# Altium project Hub-UV17.PrjPcb
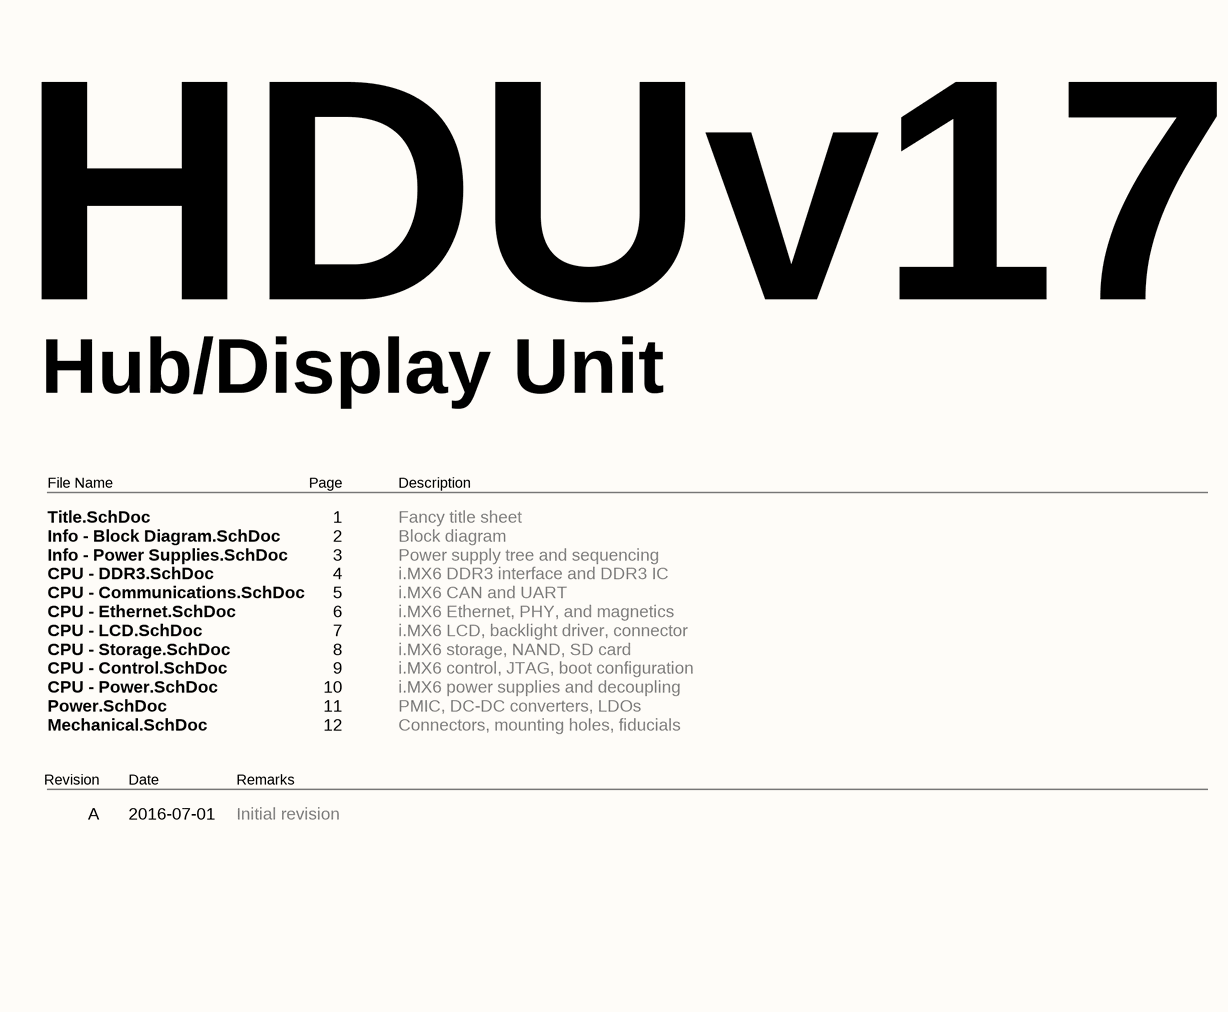
[diagram p0: Title.SchDoc]
ProjectTitle: HDU: Hub/Display Unit; ProjectRevision: A; ProjectDate: 2017-04-01; ProjectCar: UV17
10 sheets, 113 parts. Net scope: global (net labels, ports and power ports of the same name join across sheets).
Board file: Hub-UV17.PcbDoc
Sheets:
  Title.SchDoc
  Power.SchDoc
  CPU - DDR3.SchDoc
  CPU - Communications.SchDoc
  CPU - Ethernet.SchDoc
  CPU - LCD.SchDoc
  CPU - Storage.SchDoc
  CPU - Control.SchDoc
  CPU - Power.SchDoc
  Mechanical.SchDoc

## Sheet Title.SchDoc: Title
size Tabloid; Revision: A; ProjectTitle: HDU: Hub/Display Unit

### Notes on the sheet
- HDUv17
- Hub/Display Unit
- File Name
- Page
- Description
- Title.SchDoc
  Info - Block Diagram.SchDoc
  Info - Power Supplies.SchDoc
  CPU - DDR3.SchDoc
  CPU - Communications.SchDoc
  CPU - Ethernet.SchDoc
  CPU - LCD.SchDoc
  CPU - Storage.SchDoc
  CPU - Control.SchDoc
  CPU - Power.SchDoc
  Power.SchDoc
  Mechanical.SchDoc
- 1
  2
  3
  4
  5
  6
  7
  8
  9
  10
  11
  12
- Fancy title sheet
  Block diagram
  Power supply tree and sequencing
  i.MX6 DDR3 interface and DDR3 IC
  i.MX6 CAN and UART
  i.MX6 Ethernet, PHY, and magnetics
  i.MX6 LCD, backlight driver, connector
  i.MX6 storage, NAND, SD card
  i.MX6 control, JTAG, boot configuration
  i.MX6 power supplies and decoupling
  PMIC, DC-DC converters, LDOs
  Connectors, mounting holes, fiducials
- Revision
- Date
- Remarks
- Initial revision
- A
- 2016-07-01
- Date:
- Revision:
- Sheet:
- /

## Sheet Power.SchDoc: Title
size Tabloid; Revision: A; ProjectTitle: CDU: CAN Display Unit
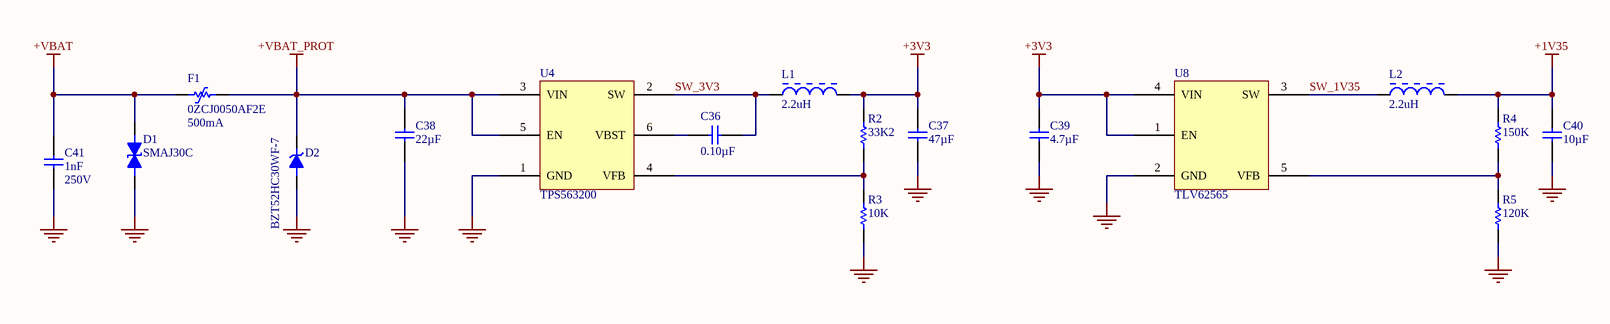
[diagram p1: Power.SchDoc]

### Parts
C36  value 0.10µF  [CAP-0402-M]  (hidden comment: CAP 0.10µF ±10% 25V 0402 X7R)
C37  value 47µF  [CAP-1210-M]  (hidden comment: CAP 47µF ±20% 6.3V 1210 X5R)
C38  value 22µF  [CAP-1210-M]  (hidden comment: CAP 22µF ±10% 25V 1210 X5R)
C39  value 4.7µF  [CAP-0805-M]  (hidden comment: CAP 4.7µF ±10% 6.3V 0805 X5R)
C40  value 10µF  [CAP-0805-M]  (hidden comment: CAP 10µF ±10% 6.3V 0805 X5R)
C41  value 1nF  Voltage: 250V  [CAP-0805-M]  (hidden comment: CAP 1nF ±10% 250V 0805 X7R)
D1  SMAJ30C  [SON127P500X135-2N]
D2  BZT52HC30WF-7  [SODFL340X115-2N]
F1  0ZCJ0050AF2E  value 500mA  [0ZCJ-1206-0.9]
L1  value 2.2uH  [INDP8080X40N]  (hidden comment: SRN8040-2R2Y)
L2  value 2.2uH  [INDP4848X28N]  (hidden comment: SRR4028-2R2Y)
R2  value 33K2  [RES-0603-M]  (hidden comment: RES 33K2 1% 1/10 W 0603 ±100ppm/°C)
R3  value 10K  [RES-0603-M]  (hidden comment: RES 10K 1% 1/10 W 0603 ±100ppm/°C)
R4  value 150K  [RES-0603-M]  (hidden comment: RES 150K 1% 1/10 W 0603 ±100ppm/°C)
R5  value 120K  [RES-0603-M]  (hidden comment: RES 120K 1% 1/10 W 0603 ±100ppm/°C)
U4  TPS563200  [TSOP95P280X110-6N]
U8  TLV62565  [SOT95P280X145-5N]

### Nets
+1V35: C40.2 L2.2 R4.2
+3V3: C37.2 C39.2 L1.2 R2.2 U8.1(EN) U8.4(VIN)
+VBAT: C41.1 D1.1 F1.1
+VBAT_PROT: C38.2 D2.1(K) F1.2 U4.3(VIN) U4.5(EN)
GND: C37.1 C38.1 C39.1 C40.1 C41.2 D1.2 D2.2(A) R3.1 R5.1 U4.1(GND) U8.2(GND)
SW_1V35: L2.1 U8.3(SW)
SW_3V3: C36.2 L1.1 U4.2(SW)
NetC36_1: C36.1 U4.6(VBST)
NetR2_1: R2.1 R3.2 U4.4(VFB)
NetR4_1: R4.1 R5.2 U8.5(VFB)

### Notes on the sheet
- Date:
- Revision:
- Sheet:
- /

### Library data of the parts
C36 = CC0402KRX7R8BB104: Manufacturer: Yageo; Manufacturer Series: CC; Part Number: CC0402KRX7R8BB104; Component Type: Standard; Tolerance: ±10%; Voltage: 25V; Package: 0402; Temperature Coefficient: X7R; Temperature Range: -55°C ~ 125°C; Supplier 1: Digi-Key; Supplier Part Number 1: 311-2077-1-ND
C37 = CC1210MKX5R5BB476: Manufacturer: Yageo; Manufacturer Series: CC; Part Number: CC1210MKX5R5BB476; Component Type: Standard; Tolerance: ±20%; Voltage: 6.3V; Package: 1210; Temperature Coefficient: X5R; Temperature Range: -55°C ~ 85°C; Supplier 1: Digi-Key; Supplier Part Number 1: 311-2047-1-ND
C38 = CC1210KKX5R8BB226: Manufacturer: Yageo; Manufacturer Series: CC; Part Number: CC1210KKX5R8BB226; Component Type: Standard; Tolerance: ±10%; Voltage: 25V; Package: 1210; Temperature Coefficient: X5R; Temperature Range: -55°C ~ 85°C; Supplier 1: Digi-Key; Supplier Part Number 1: 311-2021-1-ND
C39 = CC0805KKX5R5BB475: Manufacturer: Yageo; Manufacturer Series: CC; Part Number: CC0805KKX5R5BB475; Component Type: Standard; Tolerance: ±10%; Voltage: 6.3V; Package: 0805; Temperature Coefficient: X5R; Temperature Range: -55°C ~ 85°C; Supplier 1: Digi-Key; Supplier Part Number 1: 311-1861-1-ND
C40 = CC0805KKX5R5BB106: Manufacturer: Yageo; Manufacturer Series: CC; Part Number: CC0805KKX5R5BB106; Component Type: Standard; Tolerance: ±10%; Voltage: 6.3V; Package: 0805; Temperature Coefficient: X5R; Temperature Range: -55°C ~ 85°C; Supplier 1: Digi-Key; Supplier Part Number 1: 311-1459-1-ND
C41 = CC0805KRX7RYBB102: Manufacturer: Yageo; Manufacturer Series: CC; Part Number: CC0805KRX7RYBB102; Component Type: Standard; Tolerance: ±10%; Package: 0805; Temperature Coefficient: X7R; Temperature Range: -55°C ~ 125°C; Supplier 1: Digi-Key; Supplier Part Number 1: 311-1470-1-ND
R2 = RC0603FR-0733K2L: Manufacturer: Yageo; Manufacturer Series: RC; Power: 1/10 W; Part Number: RC0603FR-0733K2L; Component Type: Standard; Tolerance: 1%; Package: 0603; Temperature Coefficient: ±100ppm/°C; Temperature Range: -55°C ~ 155°C; Supplier 1: Digi-Key; Supplier Part Number 1: 311-33.2KHRCT-ND
R3 = RC0603FR-0710KL: Manufacturer: Yageo; Manufacturer Series: RC; Power: 1/10 W; Part Number: RC0603FR-0710KL; Component Type: Standard; Tolerance: 1%; Package: 0603; Temperature Coefficient: ±100ppm/°C; Temperature Range: -55°C ~ 155°C; Supplier 1: Digi-Key; Supplier Part Number 1: 311-10.0KHRCT-ND
R4 = RC0603FR-07150KL: Manufacturer: Yageo; Manufacturer Series: RC; Power: 1/10 W; Part Number: RC0603FR-07150KL; Component Type: Standard; Tolerance: 1%; Package: 0603; Temperature Coefficient: ±100ppm/°C; Temperature Range: -55°C ~ 155°C; Supplier 1: Digi-Key; Supplier Part Number 1: 311-150KHRCT-ND
R5 = RC0603FR-07120KL: Manufacturer: Yageo; Manufacturer Series: RC; Power: 1/10 W; Part Number: RC0603FR-07120KL; Component Type: Standard; Tolerance: 1%; Package: 0603; Temperature Coefficient: ±100ppm/°C; Temperature Range: -55°C ~ 155°C; Supplier 1: Digi-Key; Supplier Part Number 1: 311-120KHRCT-ND
U4 = TPS563200: 4.5-V To 17-V Input, 2-A, 3-A Synchronous Step-Down Voltage Regulator In  6 Pin SOT-23
U8 = TLV62565: x 1.5-A High Efficiency Step-Down Converters in SOT-23 5-Pin Package
D2 = BZT52HC30WF-7: Supplier 1: Digi-Key; Supplier Part Number 1: BZT52HC30WF-7DICT-ND

## Sheet CPU - DDR3.SchDoc: DDR3 SDRAM
size Tabloid; Revision: A; ProjectTitle: CDU: CAN Display Unit
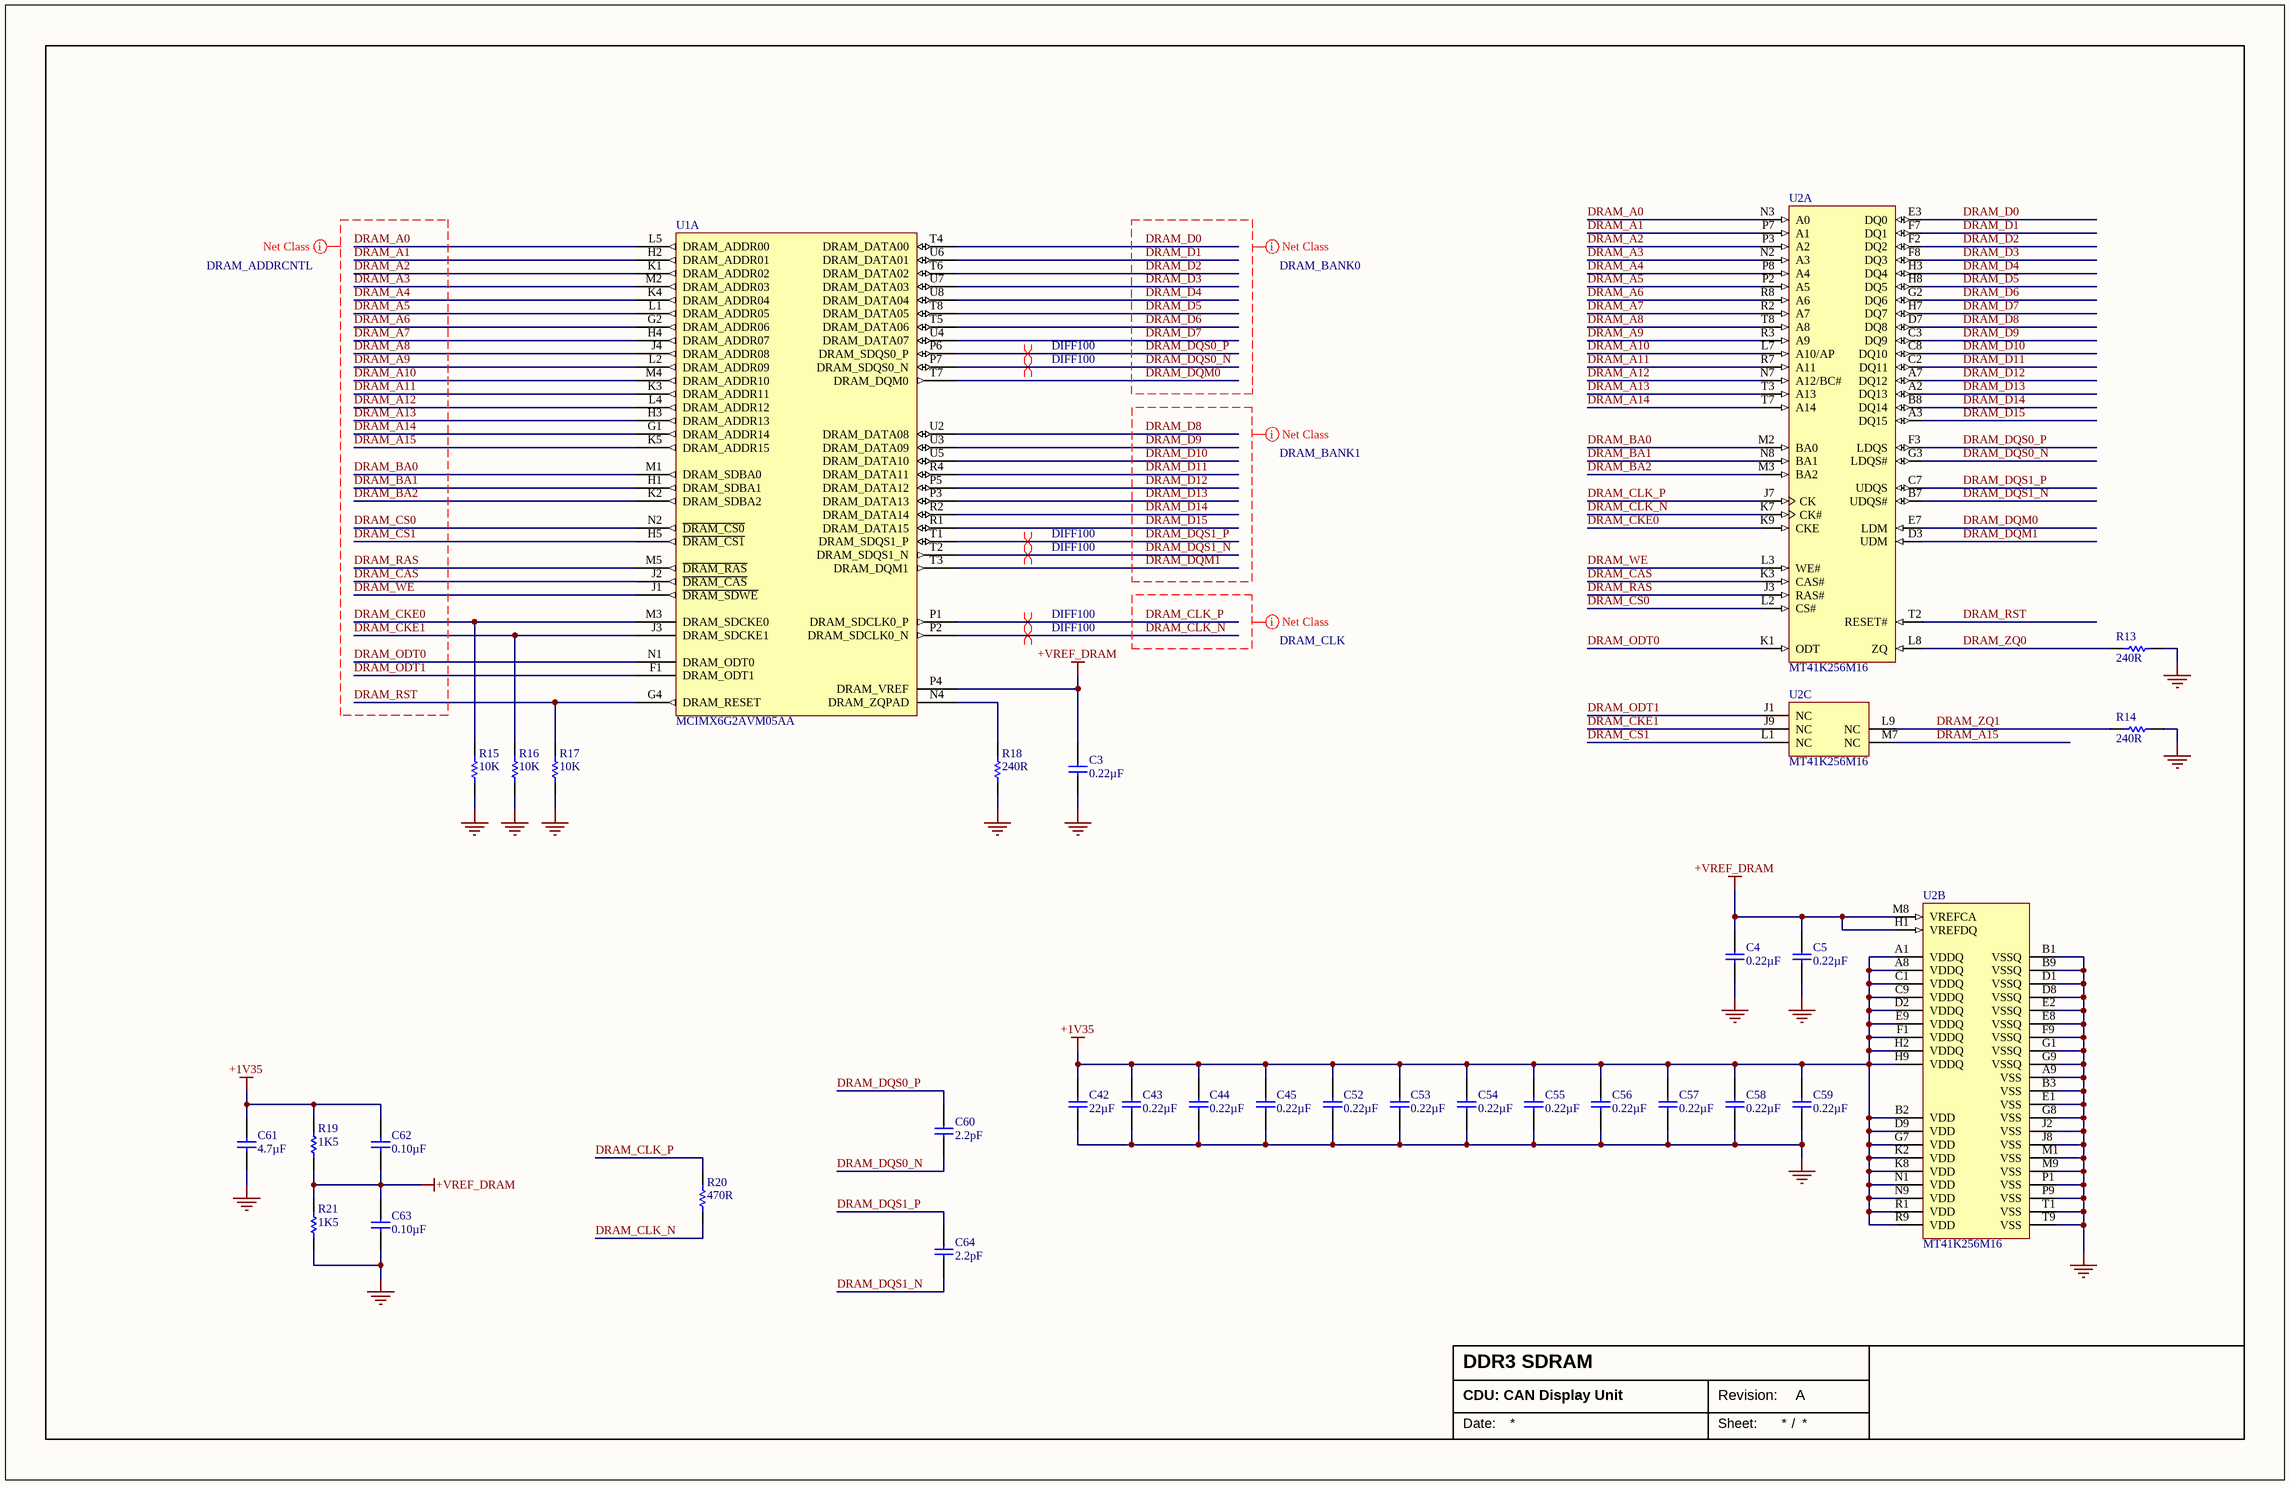
[diagram p2: CPU - DDR3.SchDoc]

### Parts
C3  value 0.22µF  [CAP-0402-M]  (hidden comment: CAP 0.22µF ±10% 16V 0402 X7R)
C4  value 0.22µF  [CAP-0402-M]  (hidden comment: CAP 0.22µF ±10% 16V 0402 X7R)
C5  value 0.22µF  [CAP-0402-M]  (hidden comment: CAP 0.22µF ±10% 16V 0402 X7R)
C42  value 22µF  [CAP-0603-M]  (hidden comment: CAP 22µF ±20% 10V 0603 X5R)
C43  value 0.22µF  [CAP-0402-M]  (hidden comment: CAP 0.22µF ±10% 16V 0402 X7R)
C44  value 0.22µF  [CAP-0402-M]  (hidden comment: CAP 0.22µF ±10% 16V 0402 X7R)
C45  value 0.22µF  [CAP-0402-M]  (hidden comment: CAP 0.22µF ±10% 16V 0402 X7R)
C52  value 0.22µF  [CAP-0402-M]  (hidden comment: CAP 0.22µF ±10% 16V 0402 X7R)
C53  value 0.22µF  [CAP-0402-M]  (hidden comment: CAP 0.22µF ±10% 16V 0402 X7R)
C54  value 0.22µF  [CAP-0402-M]  (hidden comment: CAP 0.22µF ±10% 16V 0402 X7R)
C55  value 0.22µF  [CAP-0402-M]  (hidden comment: CAP 0.22µF ±10% 16V 0402 X7R)
C56  value 0.22µF  [CAP-0402-M]  (hidden comment: CAP 0.22µF ±10% 16V 0402 X7R)
C57  value 0.22µF  [CAP-0402-M]  (hidden comment: CAP 0.22µF ±10% 16V 0402 X7R)
C58  value 0.22µF  [CAP-0402-M]  (hidden comment: CAP 0.22µF ±10% 16V 0402 X7R)
C59  value 0.22µF  [CAP-0402-M]  (hidden comment: CAP 0.22µF ±10% 16V 0402 X7R)
C60  value 2.2pF  [CAP-0402-M]  (hidden comment: CAP 2.2pF ±0.1pF 50V 0402 C0G, NP0)
C61  value 4.7µF  [CAP-0603-M]  (hidden comment: CAP 4.7µF ±10% 10V 0603 X5R)
C62  value 0.10µF  [CAP-0402-M]  (hidden comment: Capacitor)
C63  value 0.10µF  [CAP-0402-M]  (hidden comment: Capacitor)
C64  value 2.2pF  [CAP-0402-M]  (hidden comment: CAP 2.2pF ±0.1pF 50V 0402 C0G, NP0)
R13  value 240R  [RES-0402-M]  (hidden comment: RES 240R 1% 1/16W 0402)
R14  value 240R  [RES-0402-M]  (hidden comment: RES 240R 1% 1/16W 0402)
R15  value 10K  [RES-0603-M]  (hidden comment: RES 10K 1% 1/10 W 0603 ±100ppm/°C)
R16  value 10K  [RES-0603-M]  (hidden comment: RES 10K 1% 1/10 W 0603 ±100ppm/°C)
R17  value 10K  [RES-0603-M]  (hidden comment: RES 10K 1% 1/10 W 0603 ±100ppm/°C)
R18  value 240R  [RES-0402-M]  (hidden comment: RES 240R 1% 1/16W 0402)
R19  value 1K5  [RES-0603-M]  (hidden comment: RES 1K5 1% 1/10 W 0603 ±100ppm/°C)
R20  value 470R  [RES-0402-M]  (hidden comment: RES 470R 1% 1/16W 0402)
R21  value 1K5  [RES-0603-M]  (hidden comment: RES 1K5 1% 1/10 W 0603 ±100ppm/°C)
U1  MCIMX6G2AVM05AA  [BGA289C80P17X17_1400X1400X132]  (part A of 14)
U2  MT41K256M16  [MICT-HA-96]  (parts A,B,C of 3)

### Nets
+1V35: C42.2 C43.1 C44.1 C45.1 C52.1 C53.1 C54.1 C55.1 C56.1 C57.1 C58.1 C59.1 C61.2 C62.2 R19.2 U2.A1(VDDQ) U2.A8(VDDQ) U2.B2(VDD) U2.C1(VDDQ) U2.C9(VDDQ) U2.D2(VDDQ) U2.D9(VDD) U2.E9(VDDQ) U2.F1(VDDQ) U2.G7(VDD) U2.H2(VDDQ) U2.H9(VDDQ) U2.K2(VDD) U2.K8(VDD) U2.N1(VDD) U2.N9(VDD) U2.R1(VDD) U2.R9(VDD)
+VREF_DRAM: C3.1 C4.1 C5.1 C62.1 C63.2 R19.1 R21.2 U1.P4(DRAM_VREF) U2.H1(VREFDQ) U2.M8(VREFCA)
GND: C3.2 C4.2 C5.2 C42.1 C43.2 C44.2 C45.2 C52.2 C53.2 C54.2 C55.2 C56.2 C57.2 C58.2 C59.2 C61.1 C63.1 R13.1 R14.1 R15.1 R16.1 R17.1 R18.1 R21.1 U2.A9(VSS) U2.B1(VSSQ) U2.B3(VSS) U2.B9(VSSQ) U2.D1(VSSQ) U2.D8(VSSQ) U2.E1(VSS) U2.E2(VSSQ) U2.E8(VSSQ) U2.F9(VSSQ) U2.G1(VSSQ) U2.G8(VSS) U2.G9(VSSQ) U2.J2(VSS) U2.J8(VSS) U2.M1(VSS) U2.M9(VSS) U2.P1(VSS) U2.P9(VSS) U2.T1(VSS) U2.T9(VSS)
DRAM_A0: U1.L5(DRAM_ADDR00) U2.N3(A0)
DRAM_A1: U1.H2(DRAM_ADDR01) U2.P7(A1)
DRAM_A2: U1.K1(DRAM_ADDR02) U2.P3(A2)
DRAM_A3: U1.M2(DRAM_ADDR03) U2.N2(A3)
DRAM_A4: U1.K4(DRAM_ADDR04) U2.P8(A4)
DRAM_A5: U1.L1(DRAM_ADDR05) U2.P2(A5)
DRAM_A6: U1.G2(DRAM_ADDR06) U2.R8(A6)
DRAM_A7: U1.H4(DRAM_ADDR07) U2.R2(A7)
DRAM_A8: U1.J4(DRAM_ADDR08) U2.T8(A8)
DRAM_A9: U1.L2(DRAM_ADDR09) U2.R3(A9)
DRAM_A10: U1.M4(DRAM_ADDR10) U2.L7(A10/AP)
DRAM_A11: U1.K3(DRAM_ADDR11) U2.R7(A11)
DRAM_A12: U1.L4(DRAM_ADDR12) U2.N7(A12/BC#)
DRAM_A13: U1.H3(DRAM_ADDR13) U2.T3(A13)
DRAM_A14: U1.G1(DRAM_ADDR14) U2.T7(A14)
DRAM_A15: U1.K5(DRAM_ADDR15) U2.M7(NC)
DRAM_BA0: U1.M1(DRAM_SDBA0) U2.M2(BA0)
DRAM_BA1: U1.H1(DRAM_SDBA1) U2.N8(BA1)
DRAM_BA2: U1.K2(DRAM_SDBA2) U2.M3(BA2)
DRAM_CAS: U1.J2(~{DRAM_CAS}) U2.K3(CAS#)
DRAM_CKE0: R15.2 U1.M3(DRAM_SDCKE0) U2.K9(CKE)
DRAM_CKE1: R16.2 U1.J3(DRAM_SDCKE1) U2.J9(NC)
DRAM_CLK_N: R20.1 U1.P2(DRAM_SDCLK0_N) U2.K7(CK#)
DRAM_CLK_P: R20.2 U1.P1(DRAM_SDCLK0_P) U2.J7(CK)
DRAM_CS0: U1.N2(~{DRAM_CS0}) U2.L2(CS#)
DRAM_CS1: U1.H5(~{DRAM_CS1}) U2.L1(NC)
DRAM_D0: U1.T4(DRAM_DATA00) U2.E3(DQ0)
DRAM_D1: U1.U6(DRAM_DATA01) U2.F7(DQ1)
DRAM_D2: U1.T6(DRAM_DATA02) U2.F2(DQ2)
DRAM_D3: U1.U7(DRAM_DATA03) U2.F8(DQ3)
DRAM_D4: U1.U8(DRAM_DATA04) U2.H3(DQ4)
DRAM_D5: U1.T8(DRAM_DATA05) U2.H8(DQ5)
DRAM_D6: U1.T5(DRAM_DATA06) U2.G2(DQ6)
DRAM_D7: U1.U4(DRAM_DATA07) U2.H7(DQ7)
DRAM_D8: U1.U2(DRAM_DATA08) U2.D7(DQ8)
DRAM_D9: U1.U3(DRAM_DATA09) U2.C3(DQ9)
DRAM_D10: U1.U5(DRAM_DATA10) U2.C8(DQ10)
DRAM_D11: U1.R4(DRAM_DATA11) U2.C2(DQ11)
DRAM_D12: U1.P5(DRAM_DATA12) U2.A7(DQ12)
DRAM_D13: U1.P3(DRAM_DATA13) U2.A2(DQ13)
DRAM_D14: U1.R2(DRAM_DATA14) U2.B8(DQ14)
DRAM_D15: U1.R1(DRAM_DATA15) U2.A3(DQ15)
DRAM_DQM0: U1.T7(DRAM_DQM0) U2.E7(LDM)
DRAM_DQM1: U1.T3(DRAM_DQM1) U2.D3(UDM)
DRAM_DQS0_N: C60.2 U1.P7(DRAM_SDQS0_N) U2.G3(LDQS#)
DRAM_DQS0_P: C60.1 U1.P6(DRAM_SDQS0_P) U2.F3(LDQS)
DRAM_DQS1_N: C64.2 U1.T2(DRAM_SDQS1_N) U2.B7(UDQS#)
DRAM_DQS1_P: C64.1 U1.T1(DRAM_SDQS1_P) U2.C7(UDQS)
DRAM_ODT0: U1.N1(DRAM_ODT0) U2.K1(ODT)
DRAM_ODT1: U1.F1(DRAM_ODT1) U2.J1(NC)
DRAM_RAS: U1.M5(~{DRAM_RAS}) U2.J3(RAS#)
DRAM_RST: R17.2 U1.G4(DRAM_RESET) U2.T2(RESET#)
DRAM_WE: U1.J1(~{DRAM_SDWE}) U2.L3(WE#)
DRAM_ZQ0: R13.2 U2.L8(ZQ)
DRAM_ZQ1: R14.2 U2.L9(NC)
NetR18_2: R18.2 U1.N4(DRAM_ZQPAD)

### Layout directives
net class DRAM_BANK0: DRAM_D0, DRAM_D1, DRAM_D2, DRAM_D3, DRAM_D4, DRAM_D5, DRAM_D6, DRAM_D7, DRAM_DQM0, DRAM_DQS0_N, DRAM_DQS0_P
net class DRAM_BANK1: DRAM_D8, DRAM_D9, DRAM_D10, DRAM_D11, DRAM_D12, DRAM_D13, DRAM_D14, DRAM_D15, DRAM_DQM1, DRAM_DQS1_N, DRAM_DQS1_P
net class DRAM_ADDRCNTL: DRAM_A0, DRAM_A1, DRAM_A2, DRAM_A3, DRAM_A4, DRAM_A5, DRAM_A6, DRAM_A7, DRAM_A8, DRAM_A9, DRAM_A10, DRAM_A11, DRAM_A12, DRAM_A13, DRAM_A14, DRAM_A15, DRAM_BA0, DRAM_BA1, DRAM_BA2, DRAM_CAS, DRAM_CKE0, DRAM_CKE1, DRAM_CS0, DRAM_CS1, DRAM_ODT0, DRAM_ODT1, DRAM_RAS, DRAM_RST, DRAM_WE
differential pair; net class DIFF100: DRAM_CLK_N, DRAM_CLK_P, DRAM_DQS0_N, DRAM_DQS0_P, DRAM_DQS1_N, DRAM_DQS1_P
net class DRAM_CLK: DRAM_CLK_N, DRAM_CLK_P

### Notes on the sheet
- Date:
- Revision:
- Sheet:
- /

### Library data of the parts
C3-C5 C43-C45 C52-C59 = CC0402KRX7R7BB224: Manufacturer: Yageo; Manufacturer Series: CC; Part Number: CC0402KRX7R7BB224; Component Type: Standard; Tolerance: ±10%; Voltage: 16V; Package: 0402; Temperature Coefficient: X7R; Temperature Range: -55°C ~ 125°C; Supplier 1: Digi-Key; Supplier Part Number 1: 311-1708-1-ND
C42 = CC0603MRX5R6BB226: Manufacturer: Yageo; Manufacturer Series: CC; Part Number: CC0603MRX5R6BB226; Component Type: Standard; Tolerance: ±20%; Voltage: 10V; Package: 0603; Temperature Coefficient: X5R; Temperature Range: -55°C ~ 85°C; Supplier 1: Digi-Key; Supplier Part Number 1: 311-1819-1-ND
C60 C64 = CC0402BRNPO9BN2R2: Manufacturer: Yageo; Manufacturer Series: CC; Part Number: CC0402BRNPO9BN2R2; Component Type: Standard; Tolerance: ±0.1pF; Voltage: 50V; Package: 0402; Temperature Coefficient: C0G, NP0; Temperature Range: -55°C ~ 125°C; Supplier 1: Digi-Key; Supplier Part Number 1: 311-1618-1-ND
C61 = CC0603KRX5R6BB475: Manufacturer: Yageo; Manufacturer Series: CC; Part Number: CC0603KRX5R6BB475; Component Type: Standard; Tolerance: ±10%; Voltage: 10V; Package: 0603; Temperature Coefficient: X5R; Temperature Range: -55°C ~ 85°C; Supplier 1: Digi-Key; Supplier Part Number 1: 311-1455-1-ND
C62 C63 = CC0402KRX7R8BB104: Manufacturer: Yageo; Manufacturer Series: CC; Tolerance: ±10%; Voltage: 25V; Temperature Coefficient: X7R; Part Number: CC0402KRX7R8BB104; Component Type: Standard; Package: 0402; Temperature Range: -55°C ~ 125°C; Supplier 1: Digi-Key; Supplier Part Number 1: 311-2077-1-ND
R13 R14 R18 = RC0402FR-07240RL: Manufacturer: Yageo; Manufacturer Series: RC; Part Number: RC0402FR-07240RL; Component Type: Standard; Tolerance: 1%; Power: 1/16W; Package: 0402; Temperature Range: -55°C ~ 155°C; Supplier 1: Digi-Key; Supplier Part Number 1: 311-240LRCT-ND
R15-R17 = RC0603FR-0710KL: as R3 on sheet Power; Part Number: RC0603FR-0710KL; Component Type: Standard; Tolerance: 1%; Package: 0603; Temperature Coefficient: ±100ppm/°C; Temperature Range: -55°C ~ 155°C; Supplier 1: Digi-Key; Supplier Part Number 1: 311-10.0KHRCT-ND
R19 R21 = RC0603FR-071K5L: Manufacturer: Yageo; Manufacturer Series: RC; Power: 1/10 W; Part Number: RC0603FR-071K5L; Component Type: Standard; Tolerance: 1%; Package: 0603; Temperature Coefficient: ±100ppm/°C; Temperature Range: -55°C ~ 155°C; Supplier 1: Digi-Key; Supplier Part Number 1: 311-1.50KHRCT-ND
R20 = RC0402FR-07470RL: Manufacturer: Yageo; Manufacturer Series: RC; Part Number: RC0402FR-07470RL; Component Type: Standard; Tolerance: 1%; Power: 1/16W; Package: 0402; Temperature Range: -55°C ~ 155°C; Supplier 1: Digi-Key; Supplier Part Number 1: 311-470LRCT-ND

## Sheet CPU - Communications.SchDoc: Title
size Tabloid; Revision: A; ProjectTitle: CDU: CAN Display Unit
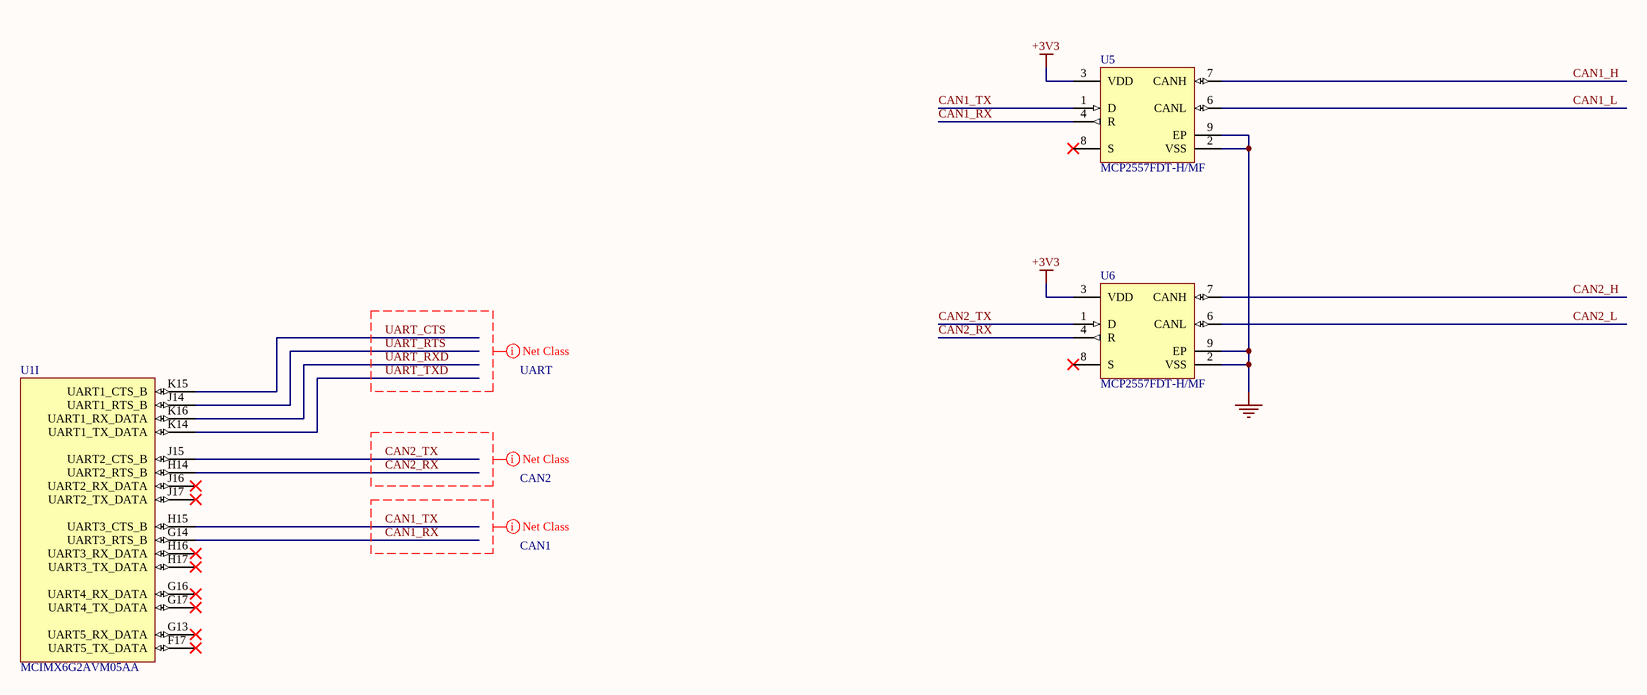
[diagram p3: CPU - Communications.SchDoc]

### Parts
U1  MCIMX6G2AVM05AA  [BGA289C80P17X17_1400X1400X132]  (part I of 14)
U5  MCP2557FDT-H/MF  [QFN65P300X300X90_HS-9N]
U6  MCP2557FDT-H/MF  [QFN65P300X300X90_HS-9N]

### Nets
+3V3: U5.3(VDD) U6.3(VDD)
GND: U5.2(VSS) U5.9(EP) U6.2(VSS) U6.9(EP)
CAN1_H: U5.7(CANH)
CAN1_L: U5.6(CANL)
CAN1_RX: U1.G14(UART3_RTS_B) U5.4(R)
CAN1_TX: U1.H15(UART3_CTS_B) U5.1(D)
CAN2_H: U6.7(CANH)
CAN2_L: U6.6(CANL)
CAN2_RX: U1.H14(UART2_RTS_B) U6.4(R)
CAN2_TX: U1.J15(UART2_CTS_B) U6.1(D)
UART_CTS: U1.K15(UART1_CTS_B)
UART_RTS: U1.J14(UART1_RTS_B)
UART_RXD: U1.K16(UART1_RX_DATA)
UART_TXD: U1.K14(UART1_TX_DATA)

Not connected (* = marked no-connect by the designer): U1 F17(UART5_TX_DATA)* G13(UART5_RX_DATA)* G16(UART4_RX_DATA)* G17(UART4_TX_DATA)* H16(UART3_RX_DATA)* H17(UART3_TX_DATA)* J16(UART2_RX_DATA)* J17(UART2_TX_DATA)*; U5 5(NC) 8(S)*; U6 5(NC) 8(S)*

### Layout directives
net class CAN2: CAN2_RX, CAN2_TX
net class CAN1: CAN1_RX, CAN1_TX
net class UART: UART_CTS, UART_RTS, UART_RXD, UART_TXD

### Notes on the sheet
- Date:
- Revision:
- Sheet:
- /

### Library data of the parts
U5 U6 = MCP2557FDT-H/MF: CAN transceiver; Supplier 1: Digi-Key; Supplier Part Number 1: MCP2557FDT-H/MFCT-ND

## Sheet CPU - Ethernet.SchDoc: Title
size Tabloid; Revision: A; ProjectTitle: CDU: CAN Display Unit
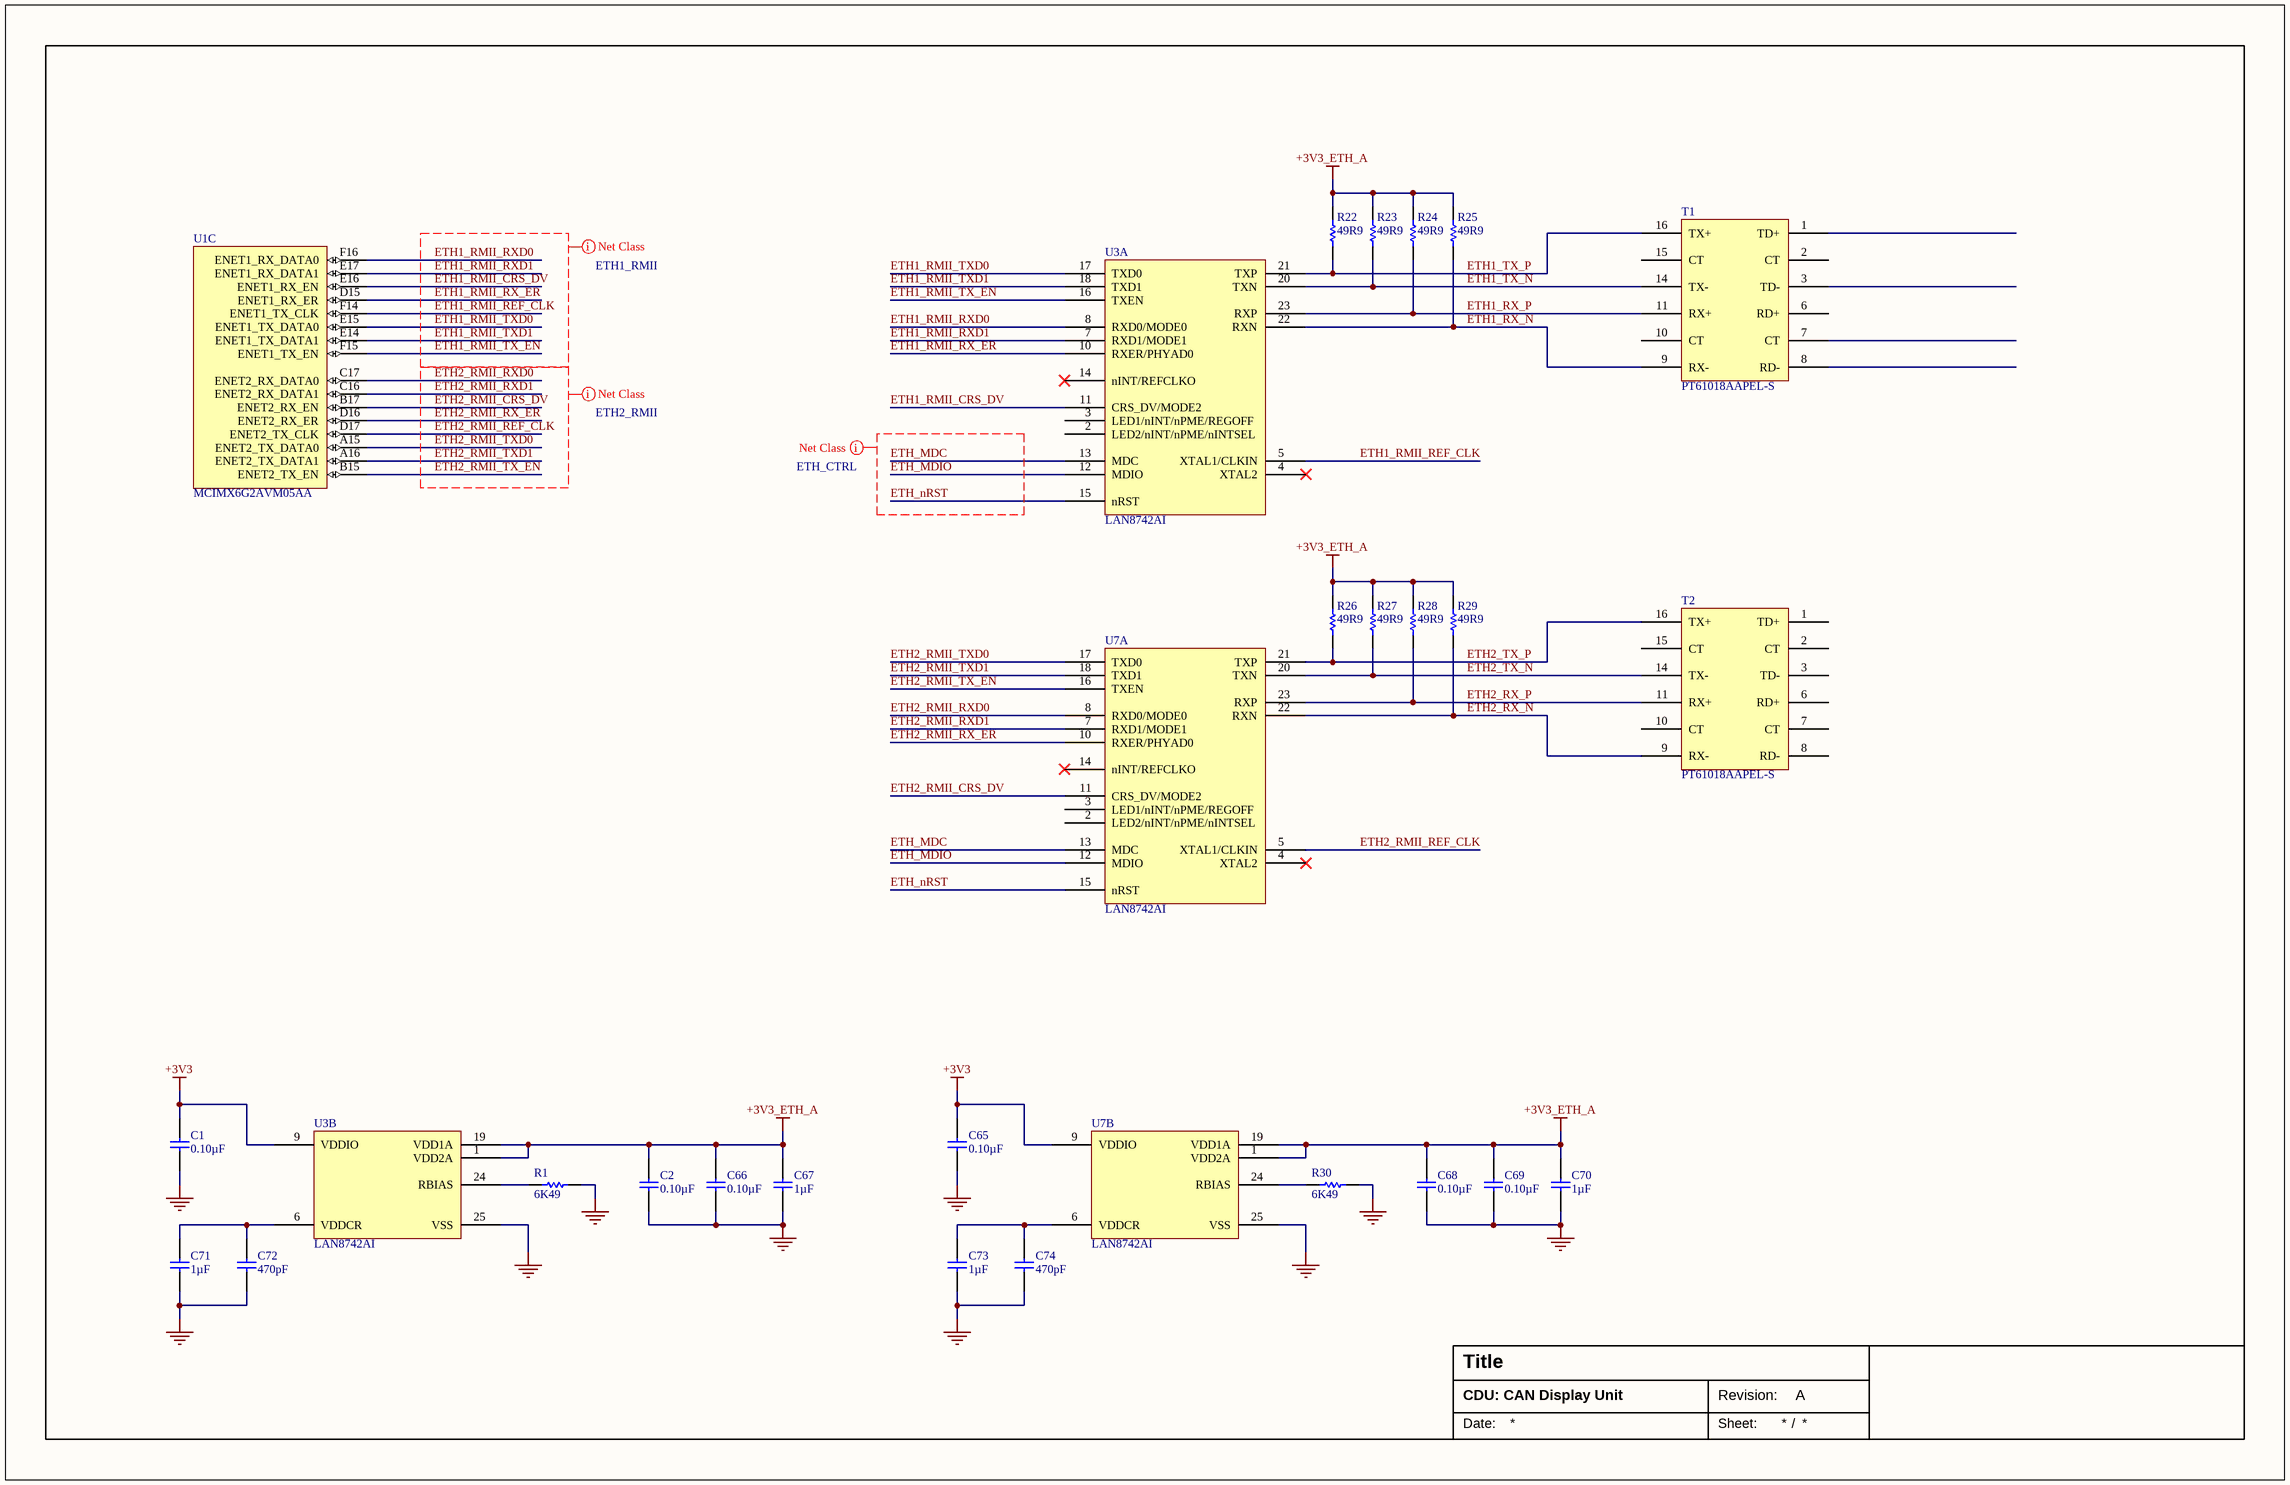
[diagram p4: CPU - Ethernet.SchDoc]

### Parts
C1  value 0.10µF  [CAP-0402-M]  (hidden comment: Capacitor)
C2  value 0.10µF  [CAP-0402-M]  (hidden comment: Capacitor)
C65  value 0.10µF  [CAP-0402-M]  (hidden comment: Capacitor)
C66  value 0.10µF  [CAP-0402-M]  (hidden comment: Capacitor)
C67  value 1µF  [CAP-0402-M]  (hidden comment: CAP 1µF ±10% 6.3V 0402 X7R)
C68  value 0.10µF  [CAP-0402-M]  (hidden comment: Capacitor)
C69  value 0.10µF  [CAP-0402-M]  (hidden comment: Capacitor)
C70  value 1µF  [CAP-0402-M]  (hidden comment: CAP 1µF ±10% 6.3V 0402 X7R)
C71  value 1µF  [CAP-0402-M]  (hidden comment: CAP 1µF ±10% 6.3V 0402 X7R)
C72  value 470pF  [CAP-0402-M]  (hidden comment: CAP 470pF ±5% 50V 0402 C0G, NP0)
C73  value 1µF  [CAP-0402-M]  (hidden comment: CAP 1µF ±10% 6.3V 0402 X7R)
C74  value 470pF  [CAP-0402-M]  (hidden comment: CAP 470pF ±5% 50V 0402 C0G, NP0)
R1  value 6K49  [RES-0603-M]  (hidden comment: Resistor)
R22  value 49R9  [RES-0402-M]  (hidden comment: RES 49R9 1% 1/16W 0402)
R23  value 49R9  [RES-0402-M]  (hidden comment: RES 49R9 1% 1/16W 0402)
R24  value 49R9  [RES-0402-M]  (hidden comment: RES 49R9 1% 1/16W 0402)
R25  value 49R9  [RES-0402-M]  (hidden comment: RES 49R9 1% 1/16W 0402)
R26  value 49R9  [RES-0402-M]  (hidden comment: RES 49R9 1% 1/16W 0402)
R27  value 49R9  [RES-0402-M]  (hidden comment: RES 49R9 1% 1/16W 0402)
R28  value 49R9  [RES-0402-M]  (hidden comment: RES 49R9 1% 1/16W 0402)
R29  value 49R9  [RES-0402-M]  (hidden comment: RES 49R9 1% 1/16W 0402)
R30  value 6K49  [RES-0603-M]  (hidden comment: Resistor)
T1  PT61018AAPEL-S  [SOIC127P930X590-16N]
T2  PT61018AAPEL-S  [SOIC127P930X590-16N]
U1  MCIMX6G2AVM05AA  [BGA289C80P17X17_1400X1400X132]  (part C of 14)
U3  LAN8742AI  [QFN50P400X400X100_HS-25N]  (parts A,B of 2)
U7  LAN8742AI  [QFN50P400X400X100_HS-25N]  (parts A,B of 2)

### Nets
+3V3: C1.2 C65.2 U3.9(VDDIO) U7.9(VDDIO)
+3V3_ETH_A: C2.2 C66.2 C67.2 C68.2 C69.2 C70.2 R22.2 R23.2 R24.2 R25.2 R26.2 R27.2 R28.2 R29.2 U3.1(VDD2A) U3.19(VDD1A) U7.1(VDD2A) U7.19(VDD1A)
GND: C1.1 C2.1 C65.1 C66.1 C67.1 C68.1 C69.1 C70.1 C71.1 C72.1 C73.1 C74.1 R1.1 R30.1 U3.25(VSS) U7.25(VSS)
ETH1_RMII_CRS_DV: U1.E16(ENET1_RX_EN) U3.11(CRS_DV/MODE2)
ETH1_RMII_REF_CLK: U1.F14(ENET1_TX_CLK) U3.5(XTAL1/CLKIN)
ETH1_RMII_RX_ER: U1.D15(ENET1_RX_ER) U3.10(RXER/PHYAD0)
ETH1_RMII_RXD0: U1.F16(ENET1_RX_DATA0) U3.8(RXD0/MODE0)
ETH1_RMII_RXD1: U1.E17(ENET1_RX_DATA1) U3.7(RXD1/MODE1)
ETH1_RMII_TX_EN: U1.F15(ENET1_TX_EN) U3.16(TXEN)
ETH1_RMII_TXD0: U1.E15(ENET1_TX_DATA0) U3.17(TXD0)
ETH1_RMII_TXD1: U1.E14(ENET1_TX_DATA1) U3.18(TXD1)
ETH1_RX_N: R25.1 T1.9(RX-) U3.22(RXN)
ETH1_RX_P: R24.1 T1.11(RX+) U3.23(RXP)
ETH1_TX_N: R23.1 T1.14(TX-) U3.20(TXN)
ETH1_TX_P: R22.1 T1.16(TX+) U3.21(TXP)
ETH2_RMII_CRS_DV: U1.B17(ENET2_RX_EN) U7.11(CRS_DV/MODE2)
ETH2_RMII_REF_CLK: U1.D17(ENET2_TX_CLK) U7.5(XTAL1/CLKIN)
ETH2_RMII_RX_ER: U1.D16(ENET2_RX_ER) U7.10(RXER/PHYAD0)
ETH2_RMII_RXD0: U1.C17(ENET2_RX_DATA0) U7.8(RXD0/MODE0)
ETH2_RMII_RXD1: U1.C16(ENET2_RX_DATA1) U7.7(RXD1/MODE1)
ETH2_RMII_TX_EN: U1.B15(ENET2_TX_EN) U7.16(TXEN)
ETH2_RMII_TXD0: U1.A15(ENET2_TX_DATA0) U7.17(TXD0)
ETH2_RMII_TXD1: U1.A16(ENET2_TX_DATA1) U7.18(TXD1)
ETH2_RX_N: R29.1 T2.9(RX-) U7.22(RXN)
ETH2_RX_P: R28.1 T2.11(RX+) U7.23(RXP)
ETH2_TX_N: R27.1 T2.14(TX-) U7.20(TXN)
ETH2_TX_P: R26.1 T2.16(TX+) U7.21(TXP)
ETH_MDC: U3.13(MDC) U7.13(MDC)
ETH_MDIO: U3.12(MDIO) U7.12(MDIO)
ETH_nRST: U3.15(nRST) U7.15(nRST)
NetC71_2: C71.2 C72.2 U3.6(VDDCR)
NetC73_2: C73.2 C74.2 U7.6(VDDCR)
NetR1_2: R1.2 U3.24(RBIAS)
NetR30_2: R30.2 U7.24(RBIAS)

Not connected (* = marked no-connect by the designer): T1 1(TD+) 2(CT) 3(TD-) 6(RD+) 7(CT) 8(RD-) 10(CT) 15(CT); T2 1(TD+) 2(CT) 3(TD-) 6(RD+) 7(CT) 8(RD-) 10(CT) 15(CT); U3 2(LED2/nINT/nPME/nINTSEL) 3(LED1/nINT/nPME/REGOFF) 4(XTAL2)* 14(nINT/REFCLKO)*; U7 2(LED2/nINT/nPME/nINTSEL) 3(LED1/nINT/nPME/REGOFF) 4(XTAL2)* 14(nINT/REFCLKO)*

### Layout directives
net class ETH1_RMII: ETH1_RMII_CRS_DV, ETH1_RMII_REF_CLK, ETH1_RMII_RX_ER, ETH1_RMII_RXD0, ETH1_RMII_RXD1, ETH1_RMII_TX_EN, ETH1_RMII_TXD0, ETH1_RMII_TXD1
net class ETH2_RMII: ETH2_RMII_CRS_DV, ETH2_RMII_REF_CLK, ETH2_RMII_RX_ER, ETH2_RMII_RXD0, ETH2_RMII_RXD1, ETH2_RMII_TX_EN, ETH2_RMII_TXD0, ETH2_RMII_TXD1
net class ETH_CTRL: ETH_MDC, ETH_MDIO, ETH_nRST

### Notes on the sheet
- Date:
- Revision:
- Sheet:
- /

### Library data of the parts
C1 C2 C65 C66 C68 C69 = CC0402KRX7R8BB104: as C62 on sheet CPU - DDR3; Part Number: CC0402KRX7R8BB104; Component Type: Standard; Package: 0402; Temperature Range: -55°C ~ 125°C; Supplier 1: Digi-Key; Supplier Part Number 1: 311-2077-1-ND
C67 C70 C71 C73 = CC0402KRX7R5BB105: Manufacturer: Yageo; Manufacturer Series: CC; Part Number: CC0402KRX7R5BB105; Component Type: Standard; Tolerance: ±10%; Voltage: 6.3V; Package: 0402; Temperature Coefficient: X7R; Temperature Range: -55°C ~ 125°C; Supplier 1: Digi-Key; Supplier Part Number 1: 311-1702-1-ND
C72 C74 = CC0402JRNPO9BN471: Manufacturer: Yageo; Manufacturer Series: CC; Part Number: CC0402JRNPO9BN471; Component Type: Standard; Tolerance: ±5%; Voltage: 50V; Package: 0402; Temperature Coefficient: C0G, NP0; Temperature Range: -55°C ~ 125°C; Supplier 1: Digi-Key; Supplier Part Number 1: 311-1671-1-ND
R1 R30 = RC0603FR-076K49L: Manufacturer: Yageo; Manufacturer Series: RC; Tolerance: 1%; Power: 1/10 W; Temperature Coefficient: ±100ppm/°C; Part Number: RC0603FR-076K49L; Component Type: Standard; Package: 0603; Temperature Range: -55°C ~ 155°C; Supplier 1: Digi-Key; Supplier Part Number 1: 311-6.49KHRCT-ND
R22-R29 = RC0402FR-0749R9L: Manufacturer: Yageo; Manufacturer Series: RC; Part Number: RC0402FR-0749R9L; Component Type: Standard; Tolerance: 1%; Power: 1/16W; Package: 0402; Temperature Range: -55°C ~ 155°C; Supplier 1: Digi-Key; Supplier Part Number 1: 311-49.9LRCT-ND

## Sheet CPU - LCD.SchDoc: Title
size Tabloid; Revision: A; ProjectTitle: CDU: CAN Display Unit
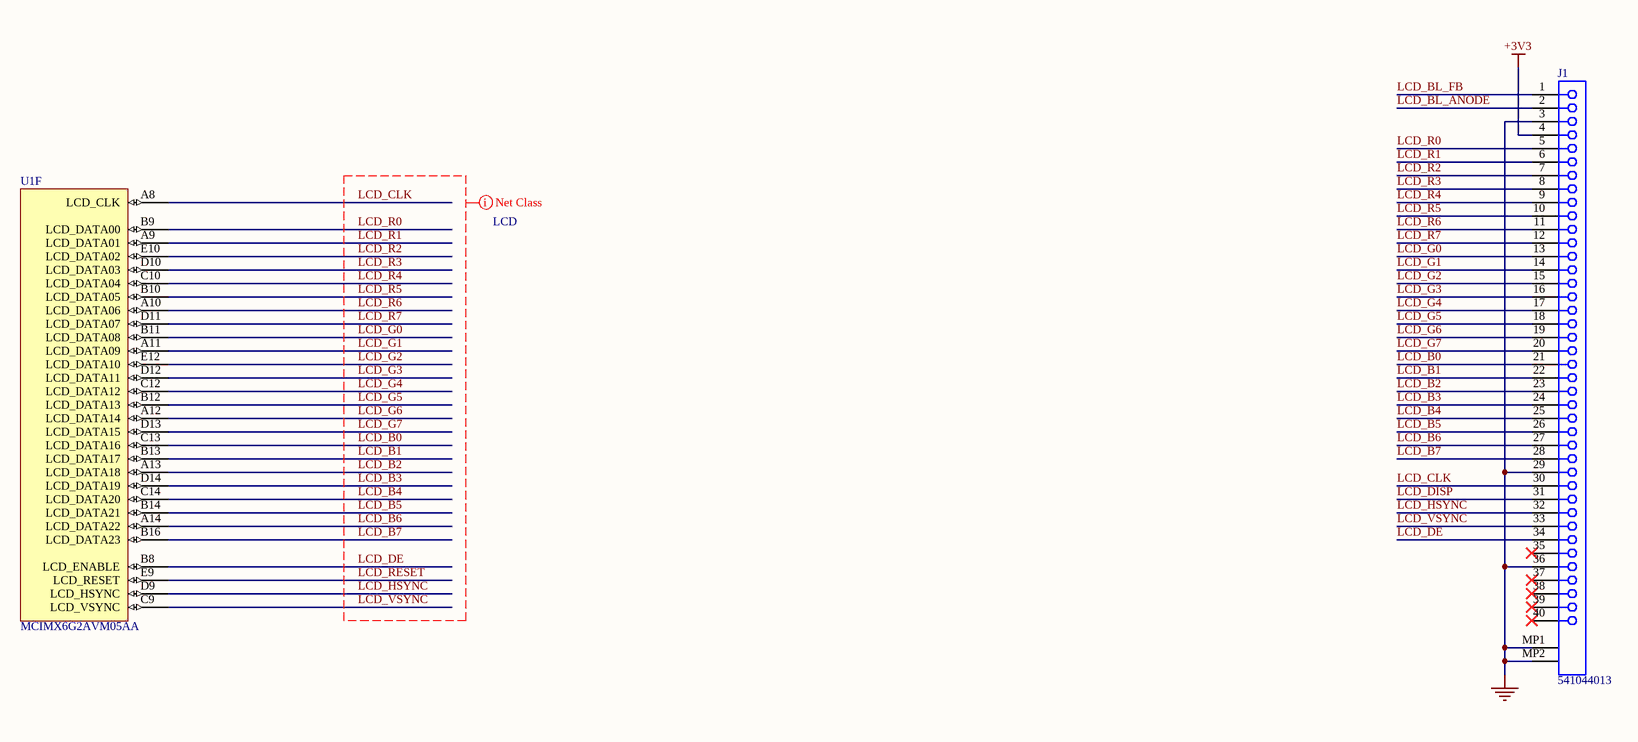
[diagram p5: CPU - LCD.SchDoc]

### Parts
J1  541044013  [MOLX-54104-4031]
U1  MCIMX6G2AVM05AA  [BGA289C80P17X17_1400X1400X132]  (part F of 14)

### Nets
+3V3: J1.4
GND: J1.3 J1.29 J1.36 J1.MP1 J1.MP2
LCD_B0: J1.21 U1.C13(LCD_DATA16)
LCD_B1: J1.22 U1.B13(LCD_DATA17)
LCD_B2: J1.23 U1.A13(LCD_DATA18)
LCD_B3: J1.24 U1.D14(LCD_DATA19)
LCD_B4: J1.25 U1.C14(LCD_DATA20)
LCD_B5: J1.26 U1.B14(LCD_DATA21)
LCD_B6: J1.27 U1.A14(LCD_DATA22)
LCD_B7: J1.28 U1.B16(LCD_DATA23)
LCD_BL_ANODE: J1.2
LCD_BL_FB: J1.1
LCD_CLK: J1.30 U1.A8(LCD_CLK)
LCD_DE: J1.34 U1.B8(LCD_ENABLE)
LCD_DISP: J1.31
LCD_G0: J1.13 U1.B11(LCD_DATA08)
LCD_G1: J1.14 U1.A11(LCD_DATA09)
LCD_G2: J1.15 U1.E12(LCD_DATA10)
LCD_G3: J1.16 U1.D12(LCD_DATA11)
LCD_G4: J1.17 U1.C12(LCD_DATA12)
LCD_G5: J1.18 U1.B12(LCD_DATA13)
LCD_G6: J1.19 U1.A12(LCD_DATA14)
LCD_G7: J1.20 U1.D13(LCD_DATA15)
LCD_HSYNC: J1.32 U1.D9(LCD_HSYNC)
LCD_R0: J1.5 U1.B9(LCD_DATA00)
LCD_R1: J1.6 U1.A9(LCD_DATA01)
LCD_R2: J1.7 U1.E10(LCD_DATA02)
LCD_R3: J1.8 U1.D10(LCD_DATA03)
LCD_R4: J1.9 U1.C10(LCD_DATA04)
LCD_R5: J1.10 U1.B10(LCD_DATA05)
LCD_R6: J1.11 U1.A10(LCD_DATA06)
LCD_R7: J1.12 U1.D11(LCD_DATA07)
LCD_RESET: U1.E9(LCD_RESET)
LCD_VSYNC: J1.33 U1.C9(LCD_VSYNC)

Not connected (* = marked no-connect by the designer): J1 35* 37* 38* 39* 40*

### Layout directives
net class LCD: LCD_B0, LCD_B1, LCD_B2, LCD_B3, LCD_B4, LCD_B5, LCD_B6, LCD_B7, LCD_CLK, LCD_DE, LCD_G0, LCD_G1, LCD_G2, LCD_G3, LCD_G4, LCD_G5, LCD_G6, LCD_G7, LCD_HSYNC, LCD_R0, LCD_R1, LCD_R2, LCD_R3, LCD_R4, LCD_R5, LCD_R6, LCD_R7, LCD_RESET, LCD_VSYNC

### Notes on the sheet
- Date:
- Revision:
- Sheet:
- /

### Library data of the parts
J1 = MOLX-54104-4031

## Sheet CPU - Storage.SchDoc: Title
size Tabloid; Revision: A; ProjectTitle: CDU: CAN Display Unit
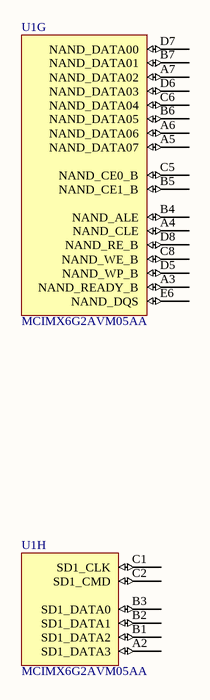
[diagram p6: CPU - Storage.SchDoc]

### Parts
U1  MCIMX6G2AVM05AA  [BGA289C80P17X17_1400X1400X132]  (parts G,H of 14)

### Nets

Not connected (* = marked no-connect by the designer): U1 A2(SD1_DATA3) A3(NAND_READY_B) A4(NAND_CLE) A5(NAND_DATA07) A6(NAND_DATA06) A7(NAND_DATA02) B1(SD1_DATA2) B2(SD1_DATA1) B3(SD1_DATA0) B4(NAND_ALE) B5(NAND_CE1_B) B6(NAND_DATA05) B7(NAND_DATA01) C1(SD1_CLK) C2(SD1_CMD) C5(NAND_CE0_B) C6(NAND_DATA04) C8(NAND_WE_B) D5(NAND_WP_B) D6(NAND_DATA03) D7(NAND_DATA00) D8(NAND_RE_B) E6(NAND_DQS)

### Notes on the sheet
- Date:
- Revision:
- Sheet:
- /

## Sheet CPU - Control.SchDoc: Title
size Tabloid; Revision: A; ProjectTitle: CDU: CAN Display Unit
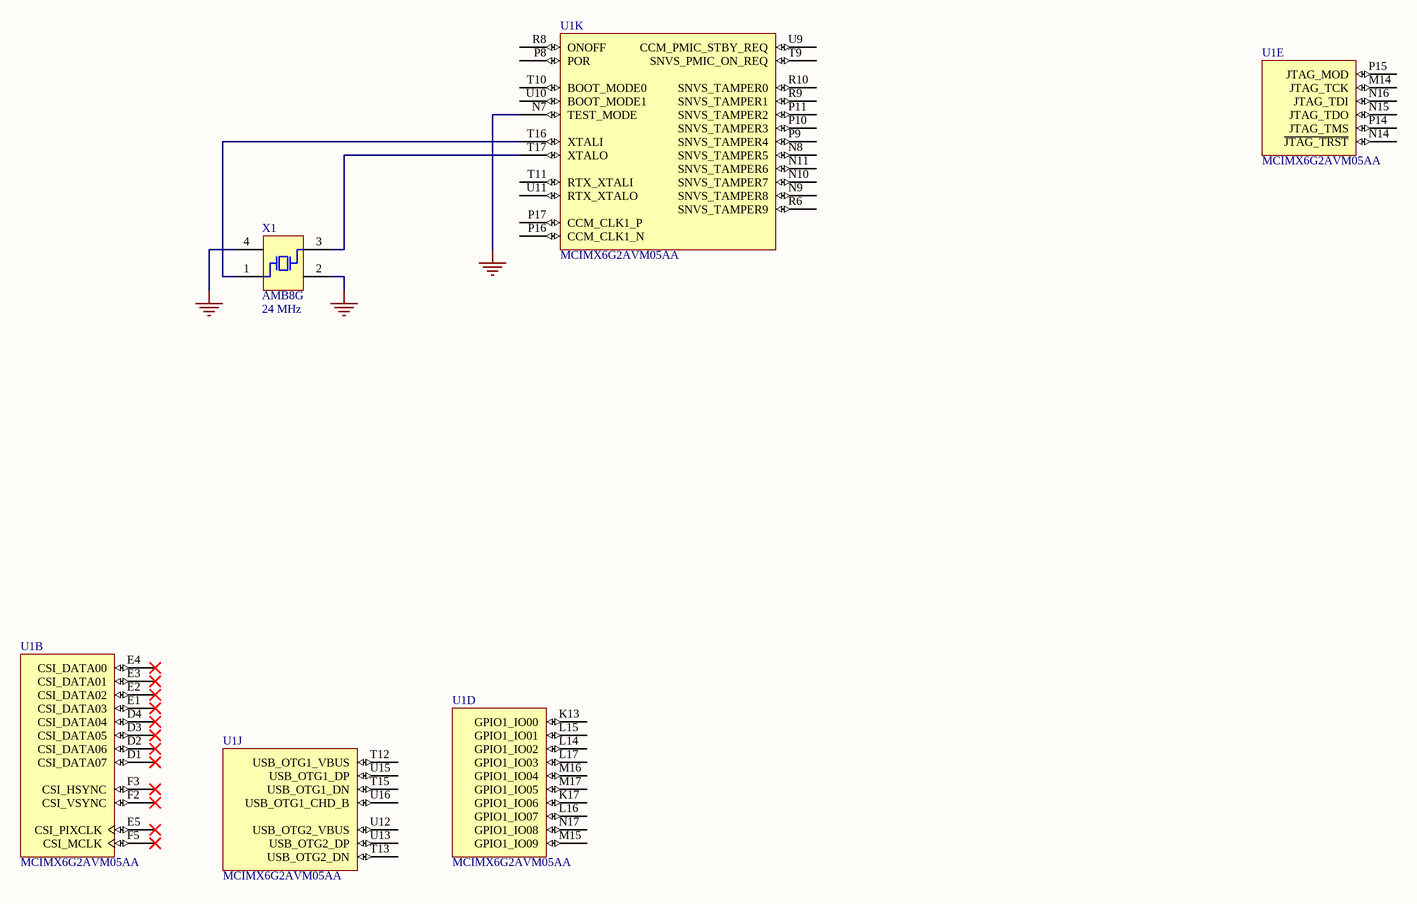
[diagram p7: CPU - Control.SchDoc]

### Parts
U1  MCIMX6G2AVM05AA  [BGA289C80P17X17_1400X1400X132]  (parts B,D,E,J,K of 14)
X1  AMB8G  value 24 MHz  [DFN220P320X100-4N]

### Nets
GND: U1.N7(TEST_MODE) X1.2 X1.4
NetU1_T16: U1.T16(XTALI) X1.1
NetU1_T17: U1.T17(XTALO) X1.3

Not connected (* = marked no-connect by the designer): U1 D1(CSI_DATA07)* D2(CSI_DATA06)* D3(CSI_DATA05)* D4(CSI_DATA04)* E1(CSI_DATA03)* E2(CSI_DATA02)* E3(CSI_DATA01)* E4(CSI_DATA00)* E5(CSI_PIXCLK)* F2(CSI_VSYNC)* F3(CSI_HSYNC)* F5(CSI_MCLK)* K13(GPIO1_IO00) K17(GPIO1_IO06) L14(GPIO1_IO02) L15(GPIO1_IO01) L16(GPIO1_IO07) L17(GPIO1_IO03) M14(JTAG_TCK) M15(GPIO1_IO09) M16(GPIO1_IO04) M17(GPIO1_IO05) N8(SNVS_TAMPER5) N9(SNVS_TAMPER8) N10(SNVS_TAMPER7) N11(SNVS_TAMPER6) N14(~{JTAG_TRST}) N15(JTAG_TDO) N16(JTAG_TDI) N17(GPIO1_IO08) P8(POR) P9(SNVS_TAMPER4) P10(SNVS_TAMPER3) P11(SNVS_TAMPER2) P14(JTAG_TMS) P15(JTAG_MOD) P16(CCM_CLK1_N) P17(CCM_CLK1_P) R6(SNVS_TAMPER9) R8(ONOFF) R9(SNVS_TAMPER1) R10(SNVS_TAMPER0) T9(SNVS_PMIC_ON_REQ) T10(BOOT_MODE0) T11(RTX_XTALI) T12(USB_OTG1_VBUS) T13(USB_OTG2_DN) T15(USB_OTG1_DN) U9(CCM_PMIC_STBY_REQ) U10(BOOT_MODE1) U11(RTX_XTALO) U12(USB_OTG2_VBUS) U13(USB_OTG2_DP) U15(USB_OTG1_DP) U16(USB_OTG1_CHD_B)

### Notes on the sheet
- Date:
- Revision:
- Sheet:
- /

### Library data of the parts
X1 = ABM8G-24.000MHZ-18-D2Y-T

## Sheet CPU - Power.SchDoc: Title
size Tabloid; Revision: A; ProjectTitle: CDU: CAN Display Unit
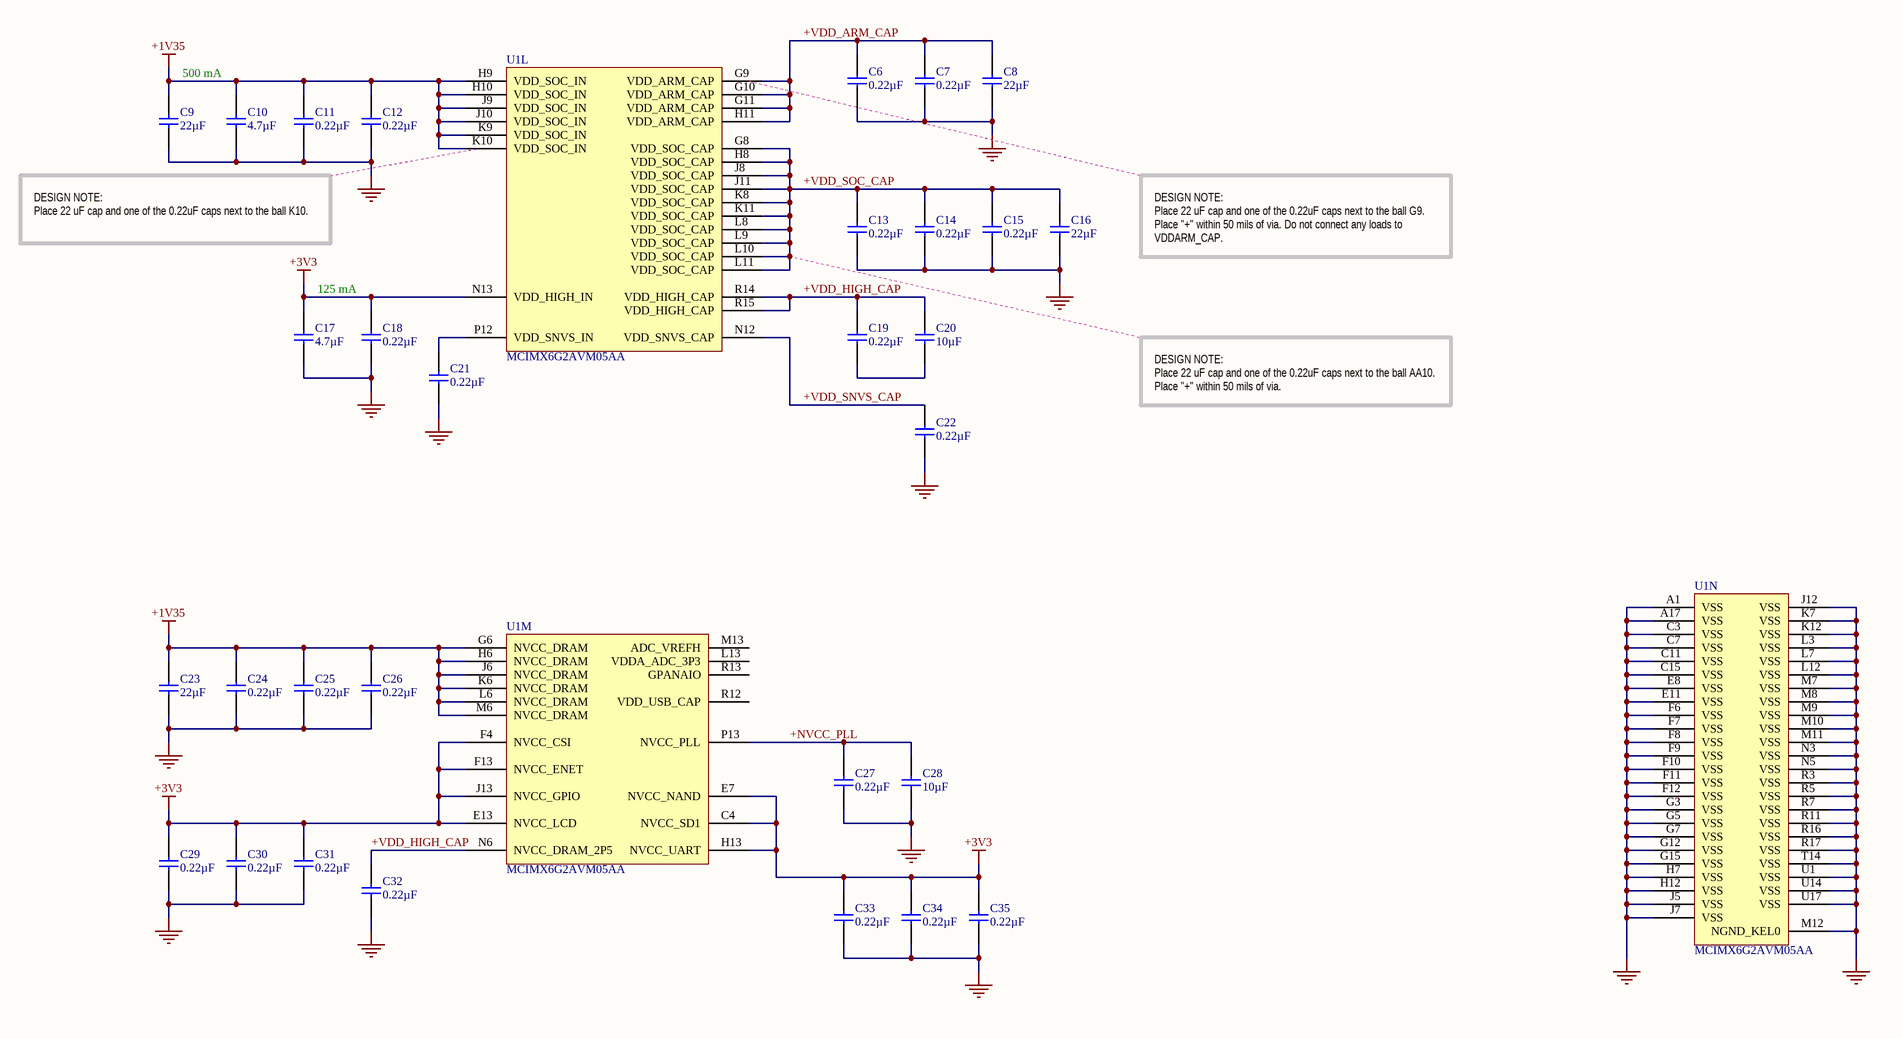
[diagram p8: CPU - Power.SchDoc]

### Parts
C6  value 0.22µF  [CAP-0402-M]  (hidden comment: Capacitor)
C7  value 0.22µF  [CAP-0402-M]  (hidden comment: Capacitor)
C8  value 22µF  [CAP-0603-M]  (hidden comment: CAP 22µF ±20% 10V 0603 X5R)
C9  value 22µF  [CAP-0603-M]  (hidden comment: CAP 22µF ±20% 10V 0603 X5R)
C10  value 4.7µF  [CAP-0402-M]  (hidden comment: Capacitor)
C11  value 0.22µF  [CAP-0402-M]  (hidden comment: Capacitor)
C12  value 0.22µF  [CAP-0402-M]  (hidden comment: Capacitor)
C13  value 0.22µF  [CAP-0402-M]  (hidden comment: Capacitor)
C14  value 0.22µF  [CAP-0402-M]  (hidden comment: Capacitor)
C15  value 0.22µF  [CAP-0402-M]  (hidden comment: Capacitor)
C16  value 22µF  [CAP-0603-M]  (hidden comment: CAP 22µF ±20% 10V 0603 X5R)
C17  value 4.7µF  [CAP-0402-M]  (hidden comment: Capacitor)
C18  value 0.22µF  [CAP-0402-M]  (hidden comment: Capacitor)
C19  value 0.22µF  [CAP-0402-M]  (hidden comment: Capacitor)
C20  value 10µF  [CAP-0603-M]  (hidden comment: CAP 10µF ±20% 6.3V 0603 X5R)
C21  value 0.22µF  [CAP-0402-M]  (hidden comment: Capacitor)
C22  value 0.22µF  [CAP-0402-M]  (hidden comment: Capacitor)
C23  value 22µF  [CAP-0603-M]  (hidden comment: CAP 22µF ±20% 10V 0603 X5R)
C24  value 0.22µF  [CAP-0402-M]  (hidden comment: Capacitor)
C25  value 0.22µF  [CAP-0402-M]  (hidden comment: Capacitor)
C26  value 0.22µF  [CAP-0402-M]  (hidden comment: Capacitor)
C27  value 0.22µF  [CAP-0402-M]  (hidden comment: Capacitor)
C28  value 10µF  [CAP-0603-M]  (hidden comment: CAP 10µF ±20% 6.3V 0603 X5R)
C29  value 0.22µF  [CAP-0402-M]  (hidden comment: Capacitor)
C30  value 0.22µF  [CAP-0402-M]  (hidden comment: Capacitor)
C31  value 0.22µF  [CAP-0402-M]  (hidden comment: Capacitor)
C32  value 0.22µF  [CAP-0402-M]  (hidden comment: Capacitor)
C33  value 0.22µF  [CAP-0402-M]  (hidden comment: Capacitor)
C34  value 0.22µF  [CAP-0402-M]  (hidden comment: Capacitor)
C35  value 0.22µF  [CAP-0402-M]  (hidden comment: Capacitor)
U1  MCIMX6G2AVM05AA  [BGA289C80P17X17_1400X1400X132]  (parts L,M,N of 14)

### Nets
+1V35: C9.2 C10.2 C11.2 C12.2 C23.2 C24.2 C25.2 C26.2 U1.G6(NVCC_DRAM) U1.H6(NVCC_DRAM) U1.H9(VDD_SOC_IN) U1.H10(VDD_SOC_IN) U1.J6(NVCC_DRAM) U1.J9(VDD_SOC_IN) U1.J10(VDD_SOC_IN) U1.K6(NVCC_DRAM) U1.K9(VDD_SOC_IN) U1.K10(VDD_SOC_IN) U1.L6(NVCC_DRAM) U1.M6(NVCC_DRAM)
+3V3: C17.2 C18.2 C29.2 C30.2 C31.2 C33.2 C34.2 C35.2 U1.C4(NVCC_SD1) U1.E7(NVCC_NAND) U1.E13(NVCC_LCD) U1.F4(NVCC_CSI) U1.F13(NVCC_ENET) U1.H13(NVCC_UART) U1.J13(NVCC_GPIO) U1.N13(VDD_HIGH_IN)
GND: C6.1 C7.1 C8.1 C9.1 C10.1 C11.1 C12.1 C13.1 C14.1 C15.1 C16.1 C17.1 C18.1 C21.1 C22.1 C23.1 C24.1 C25.1 C26.1 C27.1 C28.1 C29.1 C30.1 C31.1 C32.1 C33.1 C34.1 C35.1 U1.A1(VSS) U1.A17(VSS) U1.C3(VSS) U1.C7(VSS) U1.C11(VSS) U1.C15(VSS) U1.E8(VSS) U1.E11(VSS) U1.F6(VSS) U1.F7(VSS) U1.F8(VSS) U1.F9(VSS) U1.F10(VSS) U1.F11(VSS) U1.F12(VSS) U1.G3(VSS) U1.G5(VSS) U1.G7(VSS) U1.G12(VSS) U1.G15(VSS) U1.H7(VSS) U1.H12(VSS) U1.J5(VSS) U1.J7(VSS) U1.J12(VSS) U1.K7(VSS) U1.K12(VSS) U1.L3(VSS) U1.L7(VSS) U1.L12(VSS) U1.M7(VSS) U1.M8(VSS) U1.M9(VSS) U1.M10(VSS) U1.M11(VSS) U1.M12(NGND_KEL0) U1.N3(VSS) U1.N5(VSS) U1.R3(VSS) U1.R5(VSS) U1.R7(VSS) U1.R11(VSS) U1.R16(VSS) U1.R17(VSS) U1.T14(VSS) U1.U1(VSS) U1.U14(VSS) U1.U17(VSS)
+NVCC_PLL: C27.2 C28.2 U1.P13(NVCC_PLL)
+VDD_ARM_CAP: C6.2 C7.2 C8.2 U1.G9(VDD_ARM_CAP) U1.G10(VDD_ARM_CAP) U1.G11(VDD_ARM_CAP) U1.H11(VDD_ARM_CAP)
+VDD_HIGH_CAP: C19.2 C20.2 C32.2 U1.N6(NVCC_DRAM_2P5) U1.R14(VDD_HIGH_CAP) U1.R15(VDD_HIGH_CAP)
+VDD_SNVS_CAP: C22.2 U1.N12(VDD_SNVS_CAP)
+VDD_SOC_CAP: C13.2 C14.2 C15.2 C16.2 U1.G8(VDD_SOC_CAP) U1.H8(VDD_SOC_CAP) U1.J8(VDD_SOC_CAP) U1.J11(VDD_SOC_CAP) U1.K8(VDD_SOC_CAP) U1.K11(VDD_SOC_CAP) U1.L8(VDD_SOC_CAP) U1.L9(VDD_SOC_CAP) U1.L10(VDD_SOC_CAP) U1.L11(VDD_SOC_CAP)
NetC19_1: C19.1 C20.1
NetC21_2: C21.2 U1.P12(VDD_SNVS_IN)

Not connected (* = marked no-connect by the designer): U1 L13(VDDA_ADC_3P3) M13(ADC_VREFH) R12(VDD_USB_CAP) R13(GPANAIO)

### Notes on the sheet
- 500 mA
- DESIGN NOTE:
  Place 22 uF cap and one of the 0.22uF caps next to the ball K10.
- DESIGN NOTE:
  Place 22 uF cap and one of the 0.22uF caps next to the ball G9. Place "+" within 50 mils of via. Do not connect any loads to VDDARM_CAP.
- 125 mA
- DESIGN NOTE:
  Place 22 uF cap and one of the 0.22uF caps next to the ball AA10. Place "+" within 50 mils of via.
- Date:
- Revision:
- Sheet:
- /

### Library data of the parts
C6 C7 C11-C15 C18 C19 C21 C22 C24-C27 C29-C35 = CC0402KRX5R5BB224: Manufacturer: Yageo; Manufacturer Series: CC; Tolerance: ±10%; Voltage: 6.3V; Temperature Coefficient: X5R; Part Number: CC0402KRX5R5BB224; Component Type: Standard; Package: 0402; Temperature Range: -55°C ~ 85°C; Supplier 1: Digi-Key; Supplier Part Number 1: 311-1681-1-ND
C8 C9 C16 C23 = CC0603MRX5R6BB226: as C42 on sheet CPU - DDR3; Part Number: CC0603MRX5R6BB226; Component Type: Standard; Tolerance: ±20%; Voltage: 10V; Package: 0603; Temperature Coefficient: X5R; Temperature Range: -55°C ~ 85°C; Supplier 1: Digi-Key; Supplier Part Number 1: 311-1819-1-ND
C10 C17 = CC0402MRX5R5BB475: Manufacturer: Murata; Manufacturer Series: GRM; Tolerance: ±20%; Voltage: 6.3V; Temperature Coefficient: X5R; Part Number: CC0402MRX5R5BB475; Component Type: Standard; Package: 0402; Temperature Range: -55°C ~ 85°C; Supplier 1: Digi-Key; Supplier Part Number 1: 311-1730-1-ND
C20 C28 = CC0603MRX5R5BB106: Manufacturer: Yageo; Manufacturer Series: CC; Part Number: CC0603MRX5R5BB106; Component Type: Standard; Tolerance: ±20%; Voltage: 6.3V; Package: 0603; Temperature Coefficient: X5R; Temperature Range: -55°C ~ 85°C; Supplier 1: Digi-Key; Supplier Part Number 1: 311-1448-1-ND

## Sheet Mechanical.SchDoc: Title
size Tabloid; Revision: A; ProjectTitle: CDU: CAN Display Unit
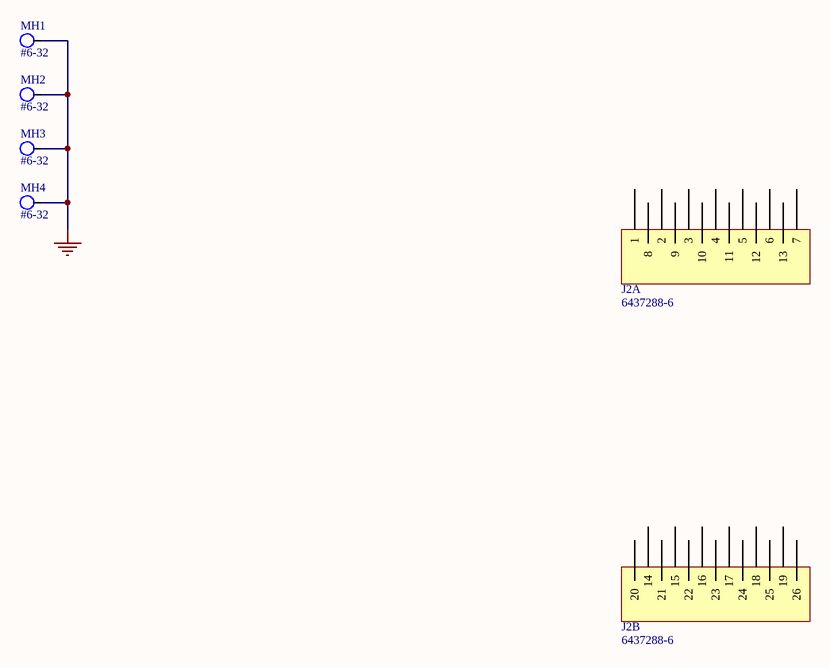
[diagram p9: Mechanical.SchDoc]

### Parts
J2  6437288-6  [6437288-6]  (parts A,B of 2)
MH1  #6-32  [MH-6-32]
MH2  #6-32  [MH-6-32]
MH3  #6-32  [MH-6-32]
MH4  #6-32  [MH-6-32]

### Nets
GND: MH1.1 MH2.1 MH3.1 MH4.1

Not connected (* = marked no-connect by the designer): J2 1 2 3 4 5 6 7 8 9 10 11 12 13 14 15 16 17 18 19 20 21 22 23 24 25 26

### Notes on the sheet
- Date:
- Revision:
- Sheet:
- /

### Library data of the parts
J2 = 6437288-6: Superseal 26-way vertical PCB header
MH1-MH4 = MH-6-32

## Nets that join several sheets
+1V35: Power (C40.2 L2.2 R4.2), CPU - DDR3 (33 pins), CPU - Power (20 pins)
+3V3: Power (6 pins), CPU - Communications (U5.3 U6.3), CPU - Ethernet (C1.2 C65.2 U3.9 U7.9), CPU - LCD (J1.4), CPU - Power (16 pins)
GND: Power (11 pins), CPU - DDR3 (45 pins), CPU - Communications (U5.2 U5.9 U6.2 U6.9), CPU - Ethernet (16 pins), CPU - LCD (5 pins), CPU - Control (U1.N7 X1.2 X1.4), CPU - Power (76 pins), Mechanical (MH1.1 MH2.1 MH3.1 MH4.1)